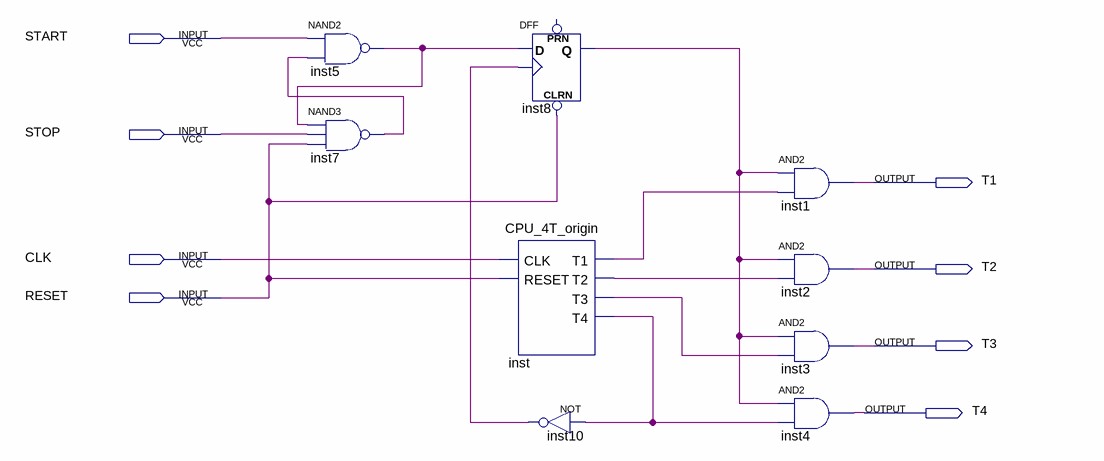
[diagram p0: schematic sheet]
// Quartus schematic CPU_4T_Final.bdf as structural Verilog: 9 symbols, 8 pins
module CPU_4T_Final (
  input  START,
  input  STOP,
  input  CLK,
  input  RESET,
  output T1,
  output T2,
  output T3,
  output T4
);

  wire inst5_out, inst7_out, inst8_q, inst10_out, inst_t1, inst_t2, inst_t3, inst_t4;

  nand inst5 (inst5_out, START, inst7_out);
  nand inst7 (inst7_out, inst5_out, STOP, RESET);
  DFF inst8 (.CLRN(RESET), .CLK(inst10_out), .D(inst5_out), .Q(inst8_q));  // open: PRN
  CPU_4T_origin inst (.CLK(CLK), .RESET(RESET), .T1(inst_t1), .T2(inst_t2), .T3(inst_t3), .T4(inst_t4));
  not inst10 (inst10_out, inst_t4);
  and inst1 (T1, inst8_q, inst_t1);
  and inst2 (T2, inst8_q, inst_t2);
  and inst3 (T3, inst8_q, inst_t3);
  and inst4 (T4, inst8_q, inst_t4);
endmodule
